# EAGLE schematic MotorShield (EAGLE 9.2.2)
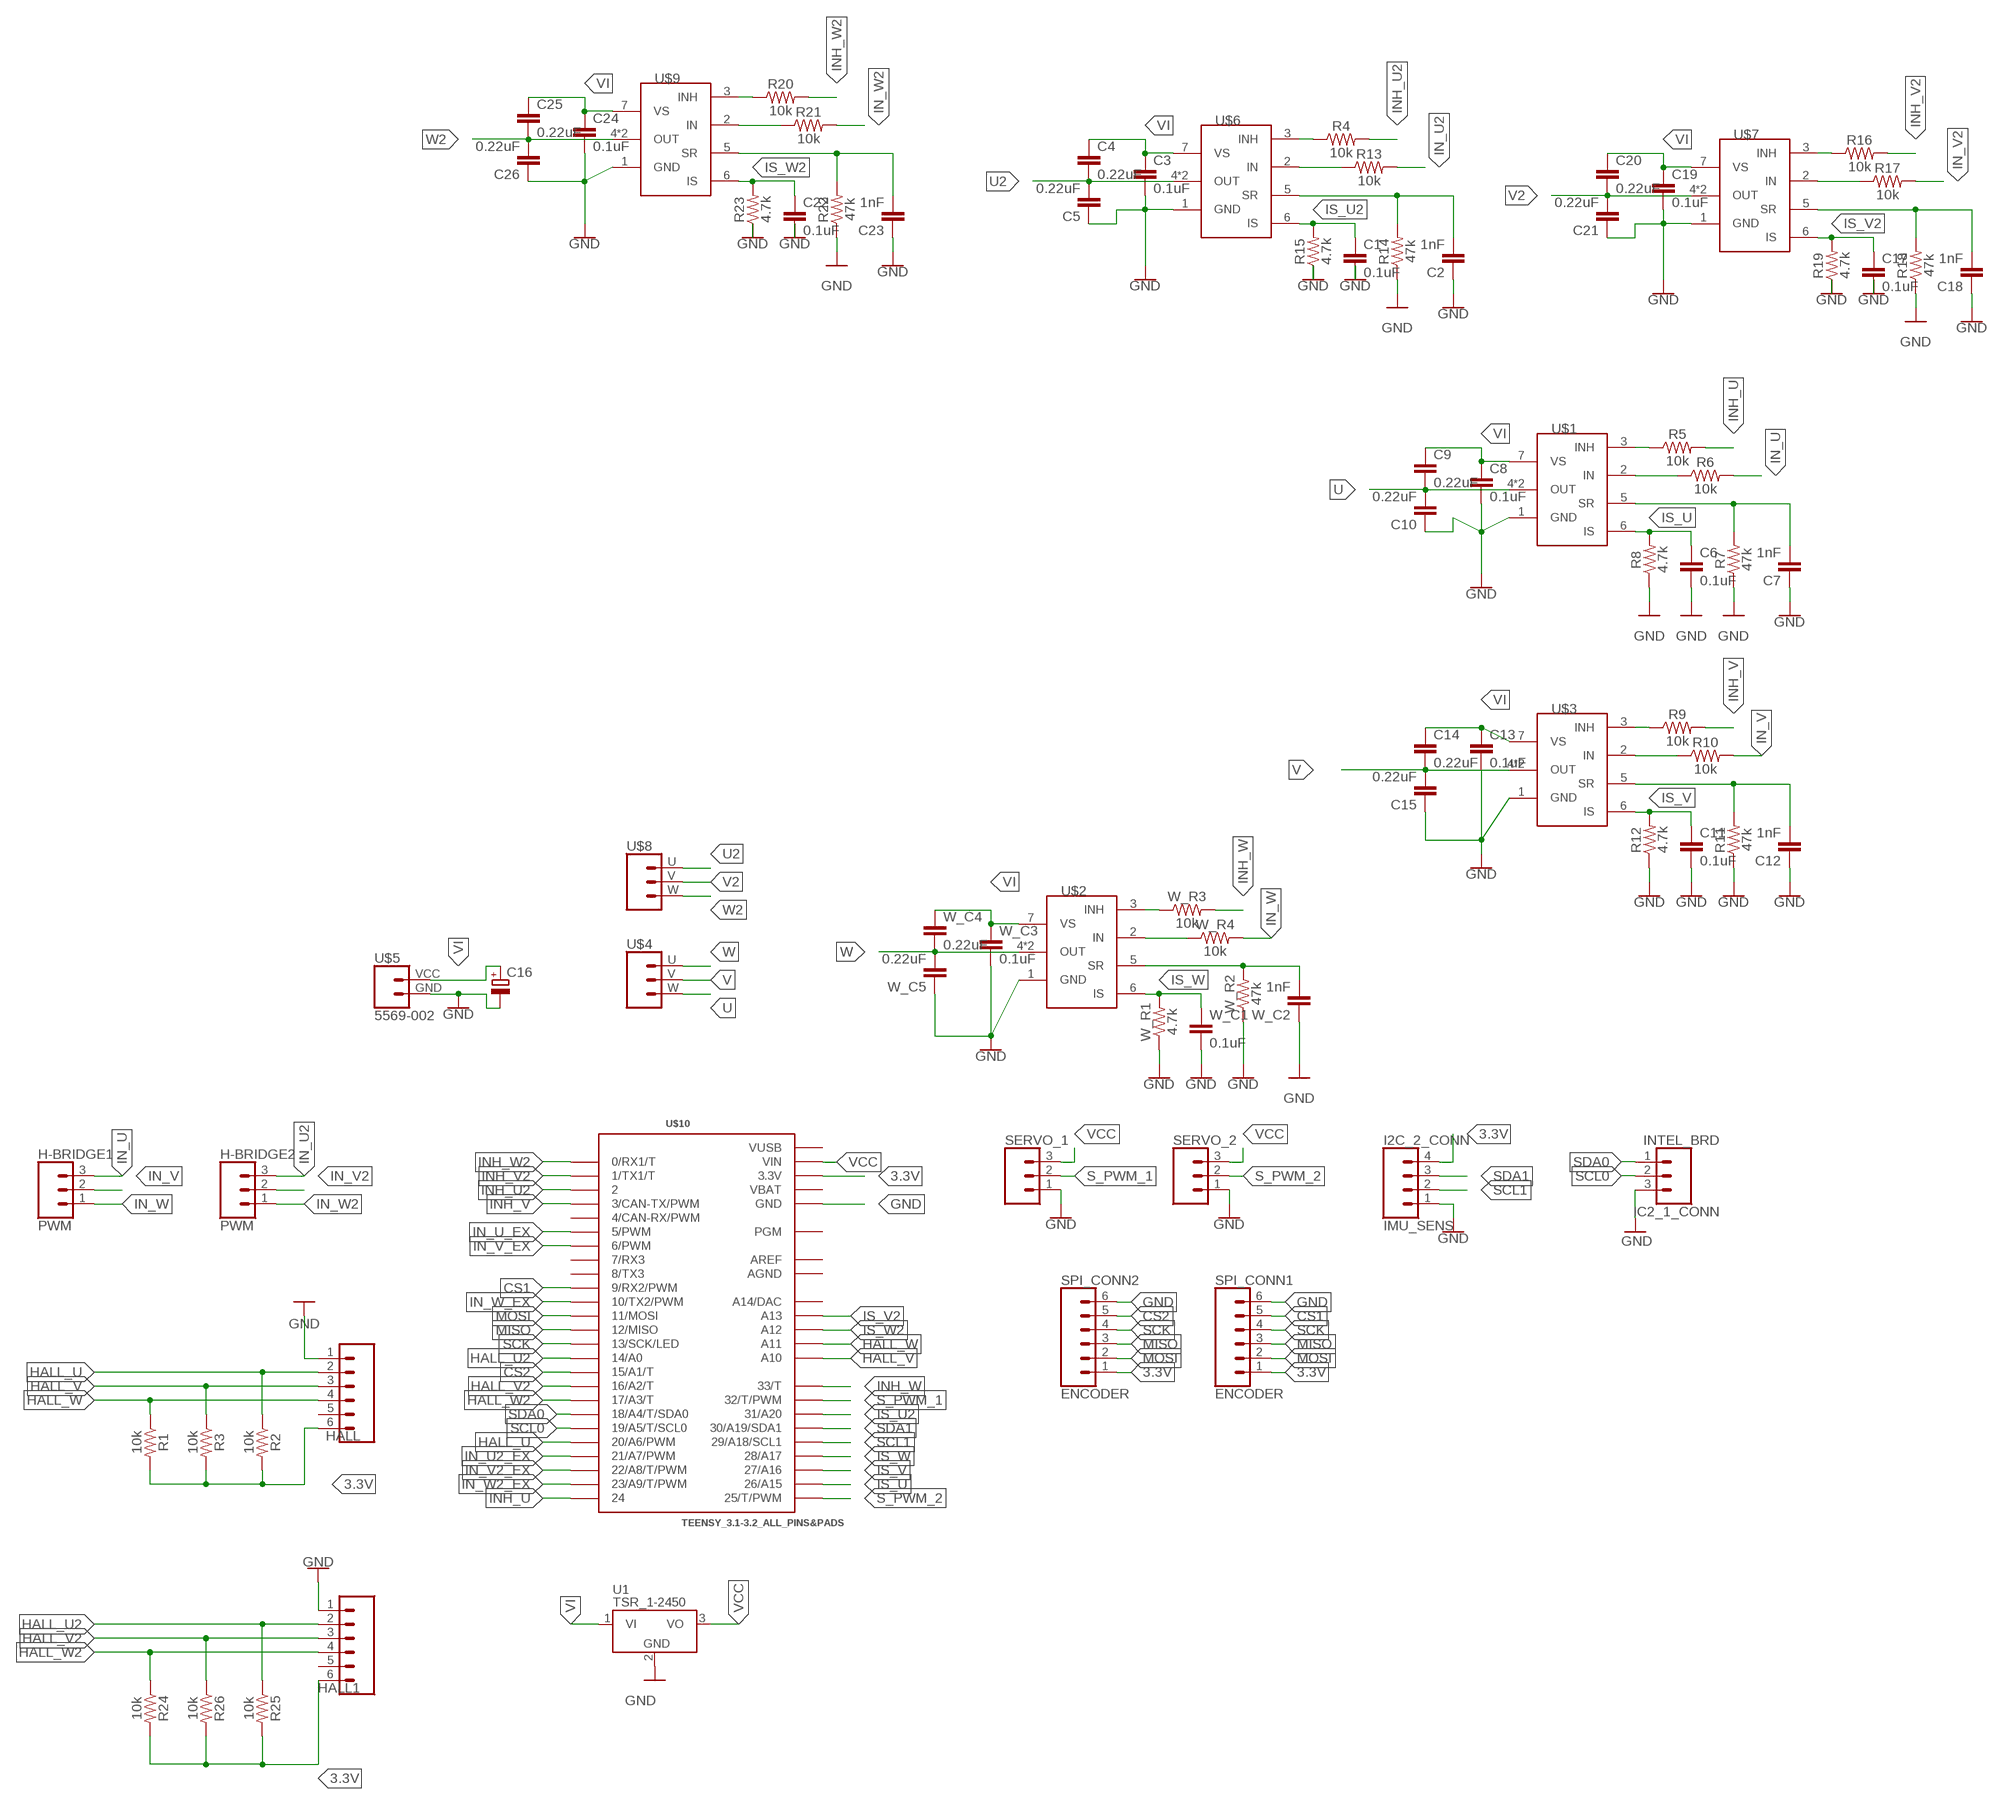
[diagram p0: schematic, sheet 1]

## Parts
C1  0.1uF  0.1UF-0603-25V-5%  [0603]
C2  1nF  1.0NF/1000PF-0603-50V-10%  [0603]
C3  0.1uF  0.1UF-0603-25V-5%  [0603]
C4  0.22uF  0.22UF-0603-25V-10%  [0603]
C5  0.22uF  0.22UF-0603-25V-10%  [0603]
C6  0.1uF  0.1UF-0603-25V-5%  [0603]
C7  1nF  1.0NF/1000PF-0603-50V-10%  [0603]
C8  0.1uF  0.1UF-0603-25V-5%  [0603]
C9  0.22uF  0.22UF-0603-25V-10%  [0603]
C10  0.22uF  0.22UF-0603-25V-10%  [0603]
C11  0.1uF  0.1UF-0603-25V-5%  [0603]
C12  1nF  1.0NF/1000PF-0603-50V-10%  [0603]
C13  0.1uF  0.1UF-0603-25V-5%  [0603]
C14  0.22uF  0.22UF-0603-25V-10%  [0603]
C15  0.22uF  0.22UF-0603-25V-10%  [0603]
C16  CPOL-EUE2,5-6E  [E2,5-6E]
C17  0.1uF  0.1UF-0603-25V-5%  [0603]
C18  1nF  1.0NF/1000PF-0603-50V-10%  [0603]
C19  0.1uF  0.1UF-0603-25V-5%  [0603]
C20  0.22uF  0.22UF-0603-25V-10%  [0603]
C21  0.22uF  0.22UF-0603-25V-10%  [0603]
C22  0.1uF  0.1UF-0603-25V-5%  [0603]
C23  1nF  1.0NF/1000PF-0603-50V-10%  [0603]
C24  0.1uF  0.1UF-0603-25V-5%  [0603]
C25  0.22uF  0.22UF-0603-25V-10%  [0603]
C26  0.22uF  0.22UF-0603-25V-10%  [0603]
H-BRIDGE1  PWM  CONN_031X03_NO_SILK  [1X03_NO_SILK]
H-BRIDGE2  PWM  CONN_031X03_NO_SILK  [1X03_NO_SILK]
HALL  CONN_06SMD-1MM  [1X06-1MM]
HALL1  CONN_06SMD-1MM  [1X06-1MM]
I2C_2_CONN  IMU_SENS  CONN_041X04_NO_SILK  [1X04_NO_SILK]
IC2_1_CONN  INTEL_BRD  CONN_031X03_NO_SILK  [1X03_NO_SILK]
R1  10k  10KOHM-0603-1/10W-1%  [0603]
R2  10k  10KOHM-0603-1/10W-1%  [0603]
R3  10k  10KOHM-0603-1/10W-1%  [0603]
R4  10k  10KOHM-0603-1/10W-1%  [0603]
R5  10k  10KOHM-0603-1/10W-1%  [0603]
R6  10k  10KOHM-0603-1/10W-1%  [0603]
R7  47k  47KOHM-0603-1/10W-1%  [0603]
R8  4.7k  4.7KOHM-0603-1/10W-1%  [0603]
R9  10k  10KOHM-0603-1/10W-1%  [0603]
R10  10k  10KOHM-0603-1/10W-1%  [0603]
R11  47k  47KOHM-0603-1/10W-1%  [0603]
R12  4.7k  4.7KOHM-0603-1/10W-1%  [0603]
R13  10k  10KOHM-0603-1/10W-1%  [0603]
R14  47k  47KOHM-0603-1/10W-1%  [0603]
R15  4.7k  4.7KOHM-0603-1/10W-1%  [0603]
R16  10k  10KOHM-0603-1/10W-1%  [0603]
R17  10k  10KOHM-0603-1/10W-1%  [0603]
R18  47k  47KOHM-0603-1/10W-1%  [0603]
R19  4.7k  4.7KOHM-0603-1/10W-1%  [0603]
R20  10k  10KOHM-0603-1/10W-1%  [0603]
R21  10k  10KOHM-0603-1/10W-1%  [0603]
R22  47k  47KOHM-0603-1/10W-1%  [0603]
R23  4.7k  4.7KOHM-0603-1/10W-1%  [0603]
R24  10k  10KOHM-0603-1/10W-1%  [0603]
R25  10k  10KOHM-0603-1/10W-1%  [0603]
R26  10k  10KOHM-0603-1/10W-1%  [0603]
SERVO_1  CONN_031X03_NO_SILK  [1X03_NO_SILK]
SERVO_2  CONN_031X03_NO_SILK  [1X03_NO_SILK]
SPI_CONN1  ENCODER  CONN_06SMD-1MM  [1X06-1MM]
SPI_CONN2  ENCODER  CONN_06SMD-1MM  [1X06-1MM]
U1  TSR_1-2450  [TSR-1]
U$1  IFX007TZZZZ  [P-TO263-7-1]
U$2  IFX007TZZZZ  [P-TO263-7-1]
U$3  IFX007TZZZZ  [P-TO263-7-1]
U$4  5569-003  [5569-003]
U$5  5569-002  [5569-002]
U$6  IFX007TZZZZ  [P-TO263-7-1]
U$7  IFX007TZZZZ  [P-TO263-7-1]
U$8  5569-003  [5569-003]
U$9  IFX007TZZZZ  [P-TO263-7-1]
U$10  TEENSY_3.1-3.2_ALL_PINS&PADS  [TEENSY_3.0-3.2_ALL_PINS_&_PADS]
W_C1  0.1uF  0.1UF-0603-25V-5%  [0603]
W_C2  1nF  1.0NF/1000PF-0603-50V-10%  [0603]
W_C3  0.1uF  0.1UF-0603-25V-5%  [0603]
W_C4  0.22uF  0.22UF-0603-25V-10%  [0603]
W_C5  0.22uF  0.22UF-0603-25V-10%  [0603]
W_R1  4.7k  4.7KOHM-0603-1/10W-1%  [0603]
W_R2  47k  47KOHM-0603-1/10W-1%  [0603]
W_R3  10k  10KOHM-0603-1/10W-1%  [0603]
W_R4  10k  10KOHM-0603-1/10W-1%  [0603]

## Nets
3.3V: HALL1.6 HALL.6 I2C_2_CONN.4 R1.2 R2.2 R3.2 R24.2 R25.2 R26.2 SPI_CONN1.1 SPI_CONN2.1 U$10.3.3V U$10.3.3V1(3.3V) U$10.3.3V2(3.3V)
CS1: SPI_CONN1.5 U$10.9(9/RX2/PWM)
CS2: SPI_CONN2.5 U$10.15/A1(15/A1/T)
GND: C1.2 C2.1 C3.2 C5.1 C6.2 C7.1 C8.2 C10.1 C11.2 C12.1 C13.2 C15.1 C16.- C17.2 C18.1 C19.2 C21.1 C22.2 C23.1 C24.2 C26.1 HALL1.1 HALL.1 I2C_2_CONN.1 IC2_1_CONN.3 R7.1 R8.1 R11.1 R12.1 R14.1 R15.1 R18.1 R19.1 R22.1 R23.1 SERVO_1.1 SERVO_2.1 SPI_CONN1.6 SPI_CONN2.6 U1.2(GND) U$1.1(GND) U$2.1(GND) U$3.1(GND) U$5.GND U$6.1(GND) U$7.1(GND) U$9.1(GND) U$10.GND U$10.GND1(GND) U$10.GND2(GND) W_C1.2 W_C2.1 W_C3.2 W_C5.1 W_R1.1 W_R2.1
HALL_U: HALL.2 R2.1 U$10.20/A6(20/A6/PWM)
HALL_U2: HALL1.2 R25.1 U$10.14/A0
HALL_V: HALL.3 R3.1 U$10.A10
HALL_V2: HALL1.3 R26.1 U$10.16/A2(16/A2/T)
HALL_W: HALL.4 R1.1 U$10.A11
HALL_W2: HALL1.4 R24.1 U$10.17/A3(17/A3/T)
IN_U: H-BRIDGE1.3 R6.2
IN_U2: H-BRIDGE2.3 R13.2
IN_U2_EX: U$10.21/A7(21/A7/PWM)
IN_U_EX: U$10.5(5/PWM)
IN_V: H-BRIDGE1.2 R10.2
IN_V2: H-BRIDGE2.2 R17.2
IN_V2_EX: U$10.22/A8(22/A8/T/PWM)
IN_V_EX: U$10.6(6/PWM)
IN_W: H-BRIDGE1.1 W_R4.2
IN_W2: H-BRIDGE2.1 R21.2
IN_W2_EX: U$10.23/A9(23/A9/T/PWM)
IN_W_EX: U$10.10(10/TX2/PWM)
INH_U: R5.2 U$10.24
INH_U2: R4.2 U$10.2
INH_V: R9.2 U$10.3(3/CAN-TX/PWM)
INH_V2: R16.2 U$10.1(1/TX1/T)
INH_W: U$10.33(33/T) W_R3.2
INH_W2: R20.2 U$10.0(0/RX1/T)
IS_U: C6.1 R8.2 U$1.6(IS) U$10.26(26/A15)
IS_U2: C1.1 R15.2 U$6.6(IS) U$10.31(31/A20)
IS_V: C11.1 R12.2 U$3.6(IS) U$10.27(27/A16)
IS_V2: C17.1 R19.2 U$7.6(IS) U$10.A13
IS_W: U$2.6(IS) U$10.28(28/A17) W_C1.1 W_R1.2
IS_W2: C22.1 R23.2 U$9.6(IS) U$10.A12
MISO: SPI_CONN1.3 SPI_CONN2.3 U$10.12(12/MISO)
MOSI: SPI_CONN1.2 SPI_CONN2.2 U$10.11(11/MOSI)
N$1: U$2.3(INH) W_R3.1
N$2: C12.2 R11.2 U$3.5(SR)
N$3: U$2.5(SR) W_C2.2 W_R2.2
N$10: C7.2 R7.2 U$1.5(SR)
N$11: R5.1 U$1.3(INH)
N$14: R6.1 U$1.2(IN)
N$17: R4.1 U$6.3(INH)
N$18: R9.1 U$3.3(INH)
N$19: R13.1 U$6.2(IN)
N$20: U$2.2(IN) W_R4.1
N$23: C2.2 R14.2 U$6.5(SR)
N$24: R10.1 U$3.2(IN)
N$26: R16.1 U$7.3(INH)
N$27: R17.1 U$7.2(IN)
N$29: C18.2 R18.2 U$7.5(SR)
N$30: R20.1 U$9.3(INH)
N$31: R21.1 U$9.2(IN)
N$33: C23.2 R22.2 U$9.5(SR)
S_PWM_1: SERVO_1.2 U$10.32(32/T/PWM)
S_PWM_2: SERVO_2.2 U$10.25(25/T/PWM)
SCK: SPI_CONN1.4 SPI_CONN2.4 U$10.13(13/SCK/LED)
SCL0: IC2_1_CONN.2 U$10.19/A5(19/A5/T/SCL0)
SCL1: I2C_2_CONN.2 U$10.29(29/A18/SCL1)
SDA0: IC2_1_CONN.1 U$10.18/A4(18/A4/T/SDA0)
SDA1: I2C_2_CONN.3 U$10.30(30/A19/SDA1)
U: C9.2 C10.2 U$1.4(OUT) U$1.8(OUT) U$4.W(V)
U2: C4.2 C5.2 U$6.4(OUT) U$6.8(OUT) U$8.U(W)
V: C14.2 C15.2 U$3.4(OUT) U$3.8(OUT) U$4.V(U)
V2: C20.2 C21.2 U$7.4(OUT) U$7.8(OUT) U$8.V(U)
VCC: SERVO_1.3 SERVO_2.3 U1.3(VO) U$10.VIN
VI: C3.1 C4.1 C8.1 C9.1 C13.1 C14.1 C16.+ C19.1 C20.1 C24.1 C25.1 U1.1(VI) U$1.7(VS) U$2.7(VS) U$3.7(VS) U$5.VCC U$6.7(VS) U$7.7(VS) U$9.7(VS) W_C3.1 W_C4.1
W: U$2.4(OUT) U$2.8(OUT) U$4.U(W) W_C4.2 W_C5.2
W2: C25.2 C26.2 U$8.W(V) U$9.4(OUT) U$9.8(OUT)
Unconnected: HALL1.5 HALL.5 U$10.4(4/CAN-RX/PWM) U$10.7(7/RX3) U$10.8(8/TX3) U$10.PGM U$10.RESET/DAC(A14/DAC)

## Power pins joined to a net without a drawn wire
AGND: U$10.AGND
AREF: U$10.AREF
VBAT: U$10.VBAT
VUSB: U$10.VUSB

## Library data of the parts
C1 C3 C6 C8 C11 C13 C17 C19 C22 C24 W_C1 W_C3 = SparkFun-Capacitors:0.1UF: 0.1µF ceramic capacitors A capacitor is a passive two-terminal electrical component used to store electrical energy temporarily in an electric field.; PROD_ID: CAP-08604
C2 C7 C12 C18 C23 W_C2 = SparkFun-Capacitors:1.0NF/1000PF: 1nF/1,000pF ceramic capacitors A capacitor is a passive two-terminal electrical component used to store electrical energy temporarily in an electric field.; PROD_ID: CAP-07886
C4 C5 C9 C10 C14 C15 C20 C21 C25 C26 W_C4 W_C5 = SparkFun-Capacitors:0.22UF: 0.22µF ceramic capacitors A capacitor is a passive two-terminal electrical component used to store electrical energy temporarily in an electric field.; PROD_ID: CAP-07822
C16 = rcl:CPOL-EU: POLARIZED CAPACITOR, European symbol; SPICEPREFIX: C
H-BRIDGE1 H-BRIDGE2 IC2_1_CONN SERVO_1 SERVO_2 = SparkFun-Connectors:CONN_03: Multi connection point. Often used as Generic Header-pin footprint for 0.1 inch spaced/style header connections On any of the 0.1 inch spaced packages, you can populate with these: Break Away Headers - Straight <https://www.sparkfun.com/products/116> (PRT-00116) Break Away Male Headers - Right Angle <https://www.sparkfun.com/products/553> (PRT-00553) Female Headers <https://www.sparkfun.com/products/115> (PRT-00115) Break Away Headers - Machine Pin <https://www.sparkfun.com/products/117> (PRT-00117) Break Away Female Headers - Swiss Machine Pin <https://www.sparkfun.com/products/743> (PRT-00743) Stackable Header - 3 Pin (Female, 0.1") <https://www.sparkfun.com/products/13875> (PRT-13875) For SCREWTERMINALS and SPRING TERMINALS visit here: Screw Terimnals on SparkFun.com <https://www.sparkfun.com/search/results?term=Screw+Terminals> (5mm/3.5mm/2.54mm spacing) This device is also useful as a general connection point to wire up your design to another part of your project. Our various solder wires solder well into these plated through hole pads. Hook-Up Wire - Assortment (Stranded, 22 AWG) <https://www.sparkfun.com/products/11375> (PRT-11375) Hook-Up Wire - Assortment (Solid Core, 22 AWG) <https://www.sparkfun.com/products/11367> (PRT-11367) View the entire wire category on our website here <https://www.sparkfun.com/categories/141> Special notes: Molex polarized connector foot print use with SKU : PRT-08232 with associated crimp pins and housings.
HALL HALL1 SPI_CONN1 SPI_CONN2 = SparkFun-Connectors:CONN_06: Multi connection point. Often used as Generic Header-pin footprint for 0.1 inch spaced/style header connections On any of the 0.1 inch spaced packages, you can populate with these: Break Away Headers - Straight <https://www.sparkfun.com/products/116> (PRT-00116) Break Away Male Headers - Right Angle <https://www.sparkfun.com/products/553> (PRT-00553) Female Headers <https://www.sparkfun.com/products/115> (PRT-00115) Break Away Headers - Machine Pin <https://www.sparkfun.com/products/117> (PRT-00117) Break Away Female Headers - Swiss Machine Pin <https://www.sparkfun.com/products/743> (PRT-00743) Arduino Stackable Header - 6 Pin <https://www.sparkfun.com/products/9280> (PRT-09280) For SCREWTERMINALS and SPRING TERMINALS visit here: Screw Terimnals on SparkFun.com <https://www.sparkfun.com/search/results?term=Screw+Terminals> (5mm/3.5mm/2.54mm spacing) This device is also useful as a general connection point to wire up your design to another part of your project. Our various solder wires solder well into these plated through hole pads. Hook-Up Wire - Assortment (Stranded, 22 AWG) <https://www.sparkfun.com/products/11375> (PRT-11375) Hook-Up Wire - Assortment (Solid Core, 22 AWG) <https://www.sparkfun.com/products/11367> (PRT-11367) View the entire wire category on our website here <https://www.sparkfun.com/categories/141>; PROD_ID: CONN-08249; SF_ID: GPS-00579
I2C_2_CONN = SparkFun-Connectors:CONN_04: Multi connection point. Often used as Generic Header-pin footprint for 0.1 inch spaced/style header connections On any of the 0.1 inch spaced packages, you can populate with these: Break Away Headers - Straight <https://www.sparkfun.com/products/116> (PRT-00116) Break Away Male Headers - Right Angle <https://www.sparkfun.com/products/553> (PRT-00553) Female Headers <https://www.sparkfun.com/products/115> (PRT-00115) Break Away Headers - Machine Pin <https://www.sparkfun.com/products/117> (PRT-00117) Break Away Female Headers - Swiss Machine Pin <https://www.sparkfun.com/products/743> (PRT-00743) For SCREWTERMINALS and SPRING TERMINALS visit here: Screw Terimnals on SparkFun.com <https://www.sparkfun.com/search/results?term=Screw+Terminals> (5mm/3.5mm/2.54mm spacing) This device is also useful as a general connection point to wire up your design to another part of your project. Our various solder wires solder well into these plated through hole pads. Hook-Up Wire - Assortment (Stranded, 22 AWG) <https://www.sparkfun.com/products/11375> (PRT-11375) Hook-Up Wire - Assortment (Solid Core, 22 AWG) <https://www.sparkfun.com/products/11367> (PRT-11367) View the entire wire category on our website here <https://www.sparkfun.com/categories/141> Special notes: Molex polarized connector foot print use with SKU : PRT-08231 with associated crimp pins and housings. 1MM SMD Version SKU: PRT-10208; PROD_ID: CONN-09696
R1-R6 R9 R10 R13 R16 R17 R20 R21 R24-R26 W_R3 W_R4 = SparkFun-Resistors:10KOHM: 10kΩ resistor A resistor is a passive two-terminal electrical component that implements electrical resistance as a circuit element. Resistors act to reduce current flow, and, at the same time, act to lower voltage levels within circuits. - Wikipedia; PROD_ID: RES-00824
R7 R11 R14 R18 R22 W_R2 = SparkFun-Resistors:47KOHM: 47kΩ resistor A resistor is a passive two-terminal electrical component that implements electrical resistance as a circuit element. Resistors act to reduce current flow, and, at the same time, act to lower voltage levels within circuits. - Wikipedia; PROD_ID: RES-07871
R8 R12 R15 R19 R23 W_R1 = SparkFun-Resistors:4.7KOHM: 4.7kΩ resistor A resistor is a passive two-terminal electrical component that implements electrical resistance as a circuit element. Resistors act to reduce current flow, and, at the same time, act to lower voltage levels within circuits. - Wikipedia; PROD_ID: RES-07857
U1 = _traco_tsr-1:TSR_1-*: TRACO TSR-1 Series Point-of-Load DC/DC-Converters Vi max. 36 V; Vo = (1.2 .. 15)V ±2%; Io = 0 .. 1 A SIP-Package (drop-in replacement for 78xx linear voltage regulators in TO220-package, vertically assembled) Source: www.tracopower.com Technologies: TSR 1- Vi (V) Vo (V) ±2% Io = 0 .. 1 A 24_ ( generic ) 2412 4.6 .. 36 1.2 2415 4.6 .. 36 1.5 2418 4.6 .. 36 1.8 2425 4.6 .. 36 2.5 2433 4.75.. 36 3.3 2450 6.5 .. 36 5.0 2465 9.0 .. 36 6.5 2490 12 .. 36 9.0 24120 15 .. 36 12 24150 18 .. 36 15 Author: Dipl.-Ing. FH Rainer Bayer HHN Hochschule Heilbronn, rainer.bayer@hs-heilbronn.de Ingenieurbüro ing-rb, mail@ing-rb.de
U$1-U$3 U$6 U$7 U$9 = ITX007T:IFX007T
U$4 U$8 = 5569-03:5569-003
U$5 = 5569-02:5569-002
U$10 = Teensy_3_and_LC_Series_Boards_v1.4:TEENSY_3.1-3.2_ALL_PINS&PADS: Footprint for Teensy 3.1 or 3.2 board using all pads and all through-holes. Pads need a 2x7 0.1" SMD header.